# Altium schematic sheet W25 Chipset - 1GBiT SPI.SchDoc
size A4; SheetNumber: 1; SheetTotal: 1
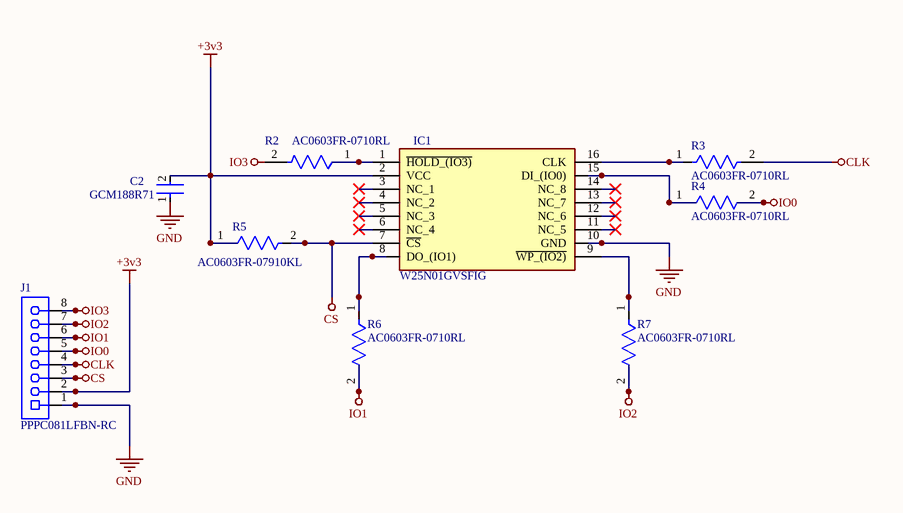
[diagram p0: W25 Chipset - 1GBiT SPI.SchDoc]

## Parts
C2  GCM188R71  [FP-GCM188-0_1-IPC_B]
IC1  W25N01GVSFIG  [SOIC127P1032X264-16N]
J1  PPPC081LFBN-RC  [SLIN-PPPC081LFBN-RC_V]
R2  AC0603FR-0710RL  [FP-AC0603-MFG]
R3  AC0603FR-0710RL  [FP-AC0603-MFG]
R4  AC0603FR-0710RL  [FP-AC0603-MFG]
R5  AC0603FR-07910KL  [FP-AC0603-IPC_B]
R6  AC0603FR-0710RL  [FP-AC0603-MFG]
R7  AC0603FR-0710RL  [FP-AC0603-MFG]

## Nets
+3v3: C2.2 IC1.2(VCC) J1.2 R5.1
CLK: J1.4 R3.2
CS: IC1.7(~{CS}) J1.3 R5.2
GND: C2.1 IC1.10(GND) J1.1
IO0: J1.5 R4.2
IO1: J1.6 R6.2
IO2: J1.7 R7.2
IO3: J1.8 R2.2
NetIC1_1: IC1.1(~{HOLD_(IO3)}) R2.1
NetIC1_8: IC1.8(DO_(IO1)) R6.1
NetIC1_9: IC1.9(~{WP_(IO2)}) R7.1
NetIC1_15: IC1.15(DI_(IO0)) R4.1
NetIC1_16: IC1.16(CLK) R3.1

Not connected (* = marked no-connect by the designer): IC1 3(NC_1)* 4(NC_2)* 5(NC_3)* 6(NC_4)* 11(NC_5)* 12(NC_6)* 13(NC_7)* 14(NC_8)*

## Library data of the parts
C2 = CMP-2006-02357-2: Ceramic Capacitor for Automotive 1uF  ±10% 16VDC X7R 0603 Paper T/R; Voltage: 16V; Thickness: 0.035inch; Width: 0.031inch; Radiation Hardening: No; Depth: 0.8mm; Max Operating Temperature: 125°C; Package Quantity: 1; Ratings: AEC-Q200; Min Operating Temperature: -55°C; Packaging: Tape and Reel; Case Code (Metric): 1608; REACH SVHC: No SVHC; Dielectric: X7R; Case Code (Imperial): 0603; Length: 1.6mm; Height: 0.8mm; Voltage Rating: 16V; Termination: SMD/SMT; Case/Package: 0603; Voltage Rating (DC): 16V; Tolerance: 10%; Capacitance: 1uF; Mount: Surface Mount; Lead Free: Lead Free
IC1 = W25N01GVSFIG: Integrated Circuit; Manufacturer_Name: Winbond; Datasheet Link: https://www.winbond.com/hq/search-resource-file.jsp?partNo=W25N01GVSFIG&type=datasheet; Height: 2.64mm; Manufacturer_Part_Number: W25N01GVSFIG; Mouser Part Number: 454-W25N01GVSFIG; Mouser Price/Stock: https://www.mouser.co.uk/ProductDetail/Winbond/W25N01GVSFIG?qs=qSfuJ%252Bfl%2Fd5wRcUOkRc5Cw%3D%3D; Arrow Part Number: W25N01GVSFIG; Arrow Price/Stock: https://www.arrow.com/en/products/w25n01gvsfig/winbond-electronics?region=nac
J1 = CMP-002-00028-2: Female Header, Pitch 2.54 mm, 1 x 8 Position, Height 8.5 mm, Tail Length 3.2 mm, -40 to 105 degC, RoHS, Bulk; Manufacturer: Sullins; Package Reference: PPPC081LFBN-RC; Connector Type: Header; Datasheet Version: Jan-15; Package Description: Female Header, Pitch 2.54 mm, 1 x 8 Position, Height 8.5 mm, Tail Length 3.2 mm; RoHS Compliant: Unknown; Max Operating Temperature: 105°C; Case/Package: PPPC081LFBN-RC; Min Operating Temperature: -40°C; Datasheet URL: http://sullinscorp.com/catalogs/101_PAGE114-115_.100_FEMALE_HDR.pdf; Gender: Female; Mounting Technology: TH
R2-R4 R6 R7 = CMP-2000-04819-3: RES 10Ω 1.00% 0.1W 0603; Tolerance: 1%; Voltage Rating: 50V; Power Rating: 100mW; Working Voltage: 75V; Resistance: 10R; Temperature Coefficient: 200ppm/°C; Case/Package: 0603; Length: 0.063inch; Technology: THICK FILM; Features: Moisture Resistant; Moisture Sensitivity Level: 1; RoHS Compliant: Yes; Number of Terminations: 2; Min Operating Temperature: -55°C; Series: AC; Package Quantity: 1; Height: 0.022inch; Case Code (Metric): 1608; Termination: SMD/SMT; Packaging: Tape and Reel; Max Operating Temperature: 155°C; Width: 0.031inch; Resistor Type: Thick Film; Max Power Dissipation: 100mW; Case Code (Imperial): 0603; Lead Free: Lead Free
R5 = CMP-03412-028406-2: RES 910KΩ 1.00% 0.1W 0603; Voltage Rating: 50V; Power Rating: 100mW; Tolerance: 1%; Temperature Coefficient: 100ppm/°C; Resistance: 910kR; Max Operating Temperature: 155°C; Resistor Type: Thick Film; Case Code (Metric): 1608; Number of Terminations: 2; Case/Package: 0603; Packaging: Tape and Reel; Length: 0.063inch; Width: 0.8mm; Case Code (Imperial): 0603; Series: AC; RoHS Compliant: Yes; Termination: SMD/SMT; Min Operating Temperature: -55°C; Max Power Dissipation: 100mW; Features: Moisture Resistant; Height: 0.022inch